# EAGLE schematic Filamint Schematic V3.1 (EAGLE 7.7.0)
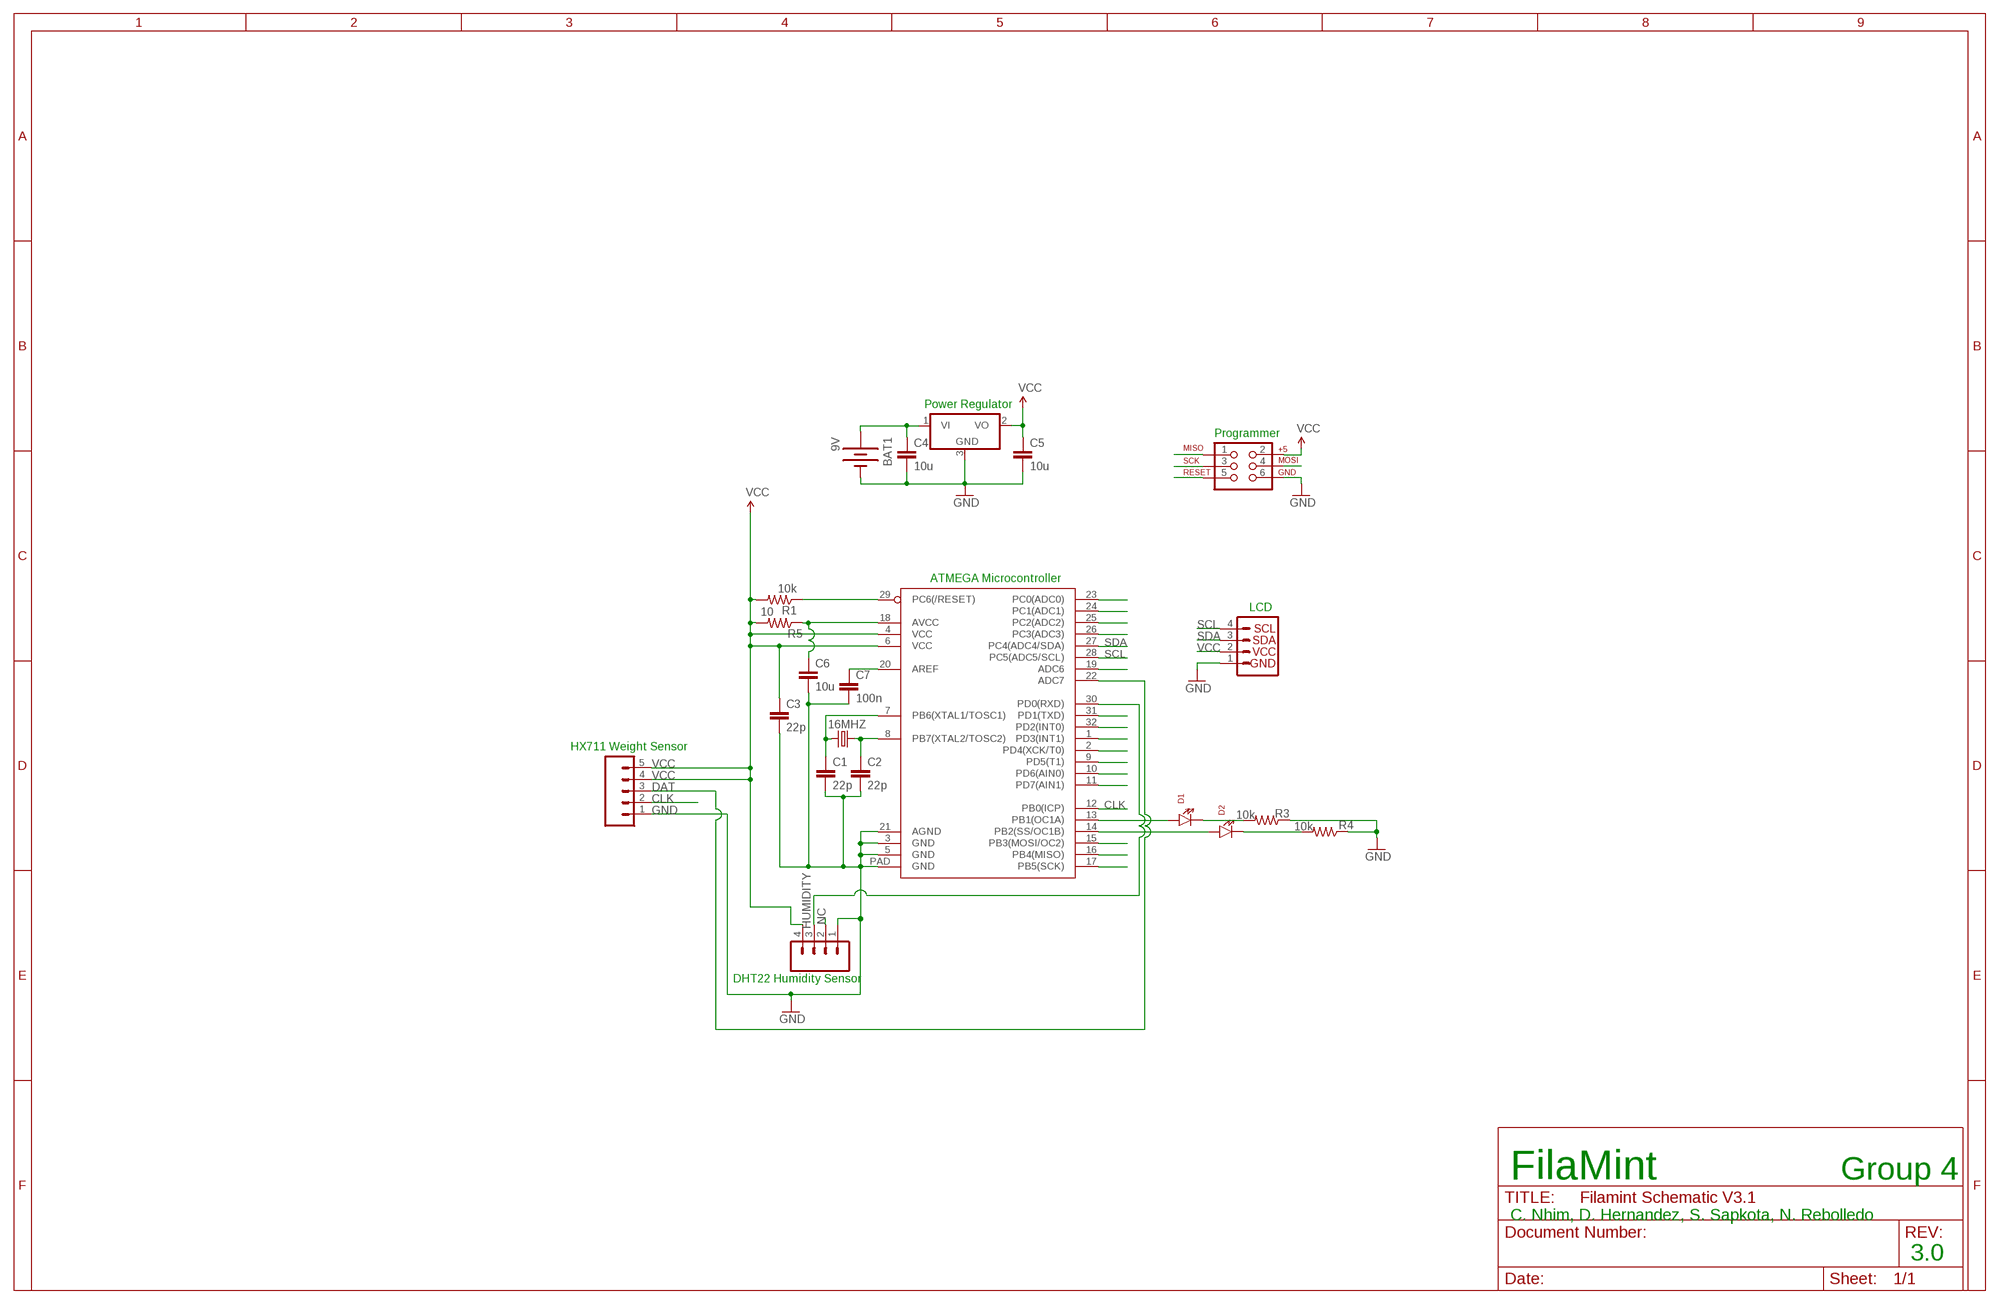
[diagram p0: schematic, sheet 1]

## Parts
16MHZ  CSM-7X-DU  [CSM-7X-DU]
BAT1  9V  BATTERY9V  [BATTCON_9V]
C1  22p  C-EU025-024X044  [C025-024X044]
C2  22p  C-EU025-024X044  [C025-024X044]
C3  22p  C-EU025-024X044  [C025-024X044]
C4  10u  C-EU025-024X044  [C025-024X044]
C5  10u  C-EU025-024X044  [C025-024X044]
C6  10u  C-EU025-024X044  [C025-024X044]
C7  100n  C-EU025-024X044  [C025-024X044]
D1  LTE-302  [LTE-302]
D2  LTE-302  [LTE-302]
DHT22  M04SMD2  [1X04-1MM-RA]
HX711  M05SMD  [1X05-1MM]
IC1  7805DT  [TO252]
LCD  I2C_STANDARD  [1X04]
MICROCONTROLLER  ATMEGA328P_MLFMLF32  [MLF32-PAD]
PROGRAMMER  AVR_SPI_PRG_6PTH  [2X3]
R1  10k  R-US_0204/5  [0204/5]
R3  10k  R-US_0204/5  [0204/5]
R4  10k  R-US_0204/5  [0204/5]
R5  10  R-US_0204/5  [0204/5]

## Nets
AVCC: C6.1 MICROCONTROLLER.18(AVCC) R5.1
CLK: HX711.2 MICROCONTROLLER.12(PB0(ICP))
DAT: HX711.3 MICROCONTROLLER.22(ADC7)
GND: BAT1.- C1.2 C2.2 C3.2 C4.2 C5.2 C6.2 C7.2 DHT22.1 HX711.1 IC1.3(GND) LCD.1 MICROCONTROLLER.3(GND) MICROCONTROLLER.5(GND) MICROCONTROLLER.21(AGND) MICROCONTROLLER.PAD(GND) PROGRAMMER.6 R3.1 R4.1
HUMIDITY: DHT22.3 MICROCONTROLLER.30(PD0(RXD))
MISO: MICROCONTROLLER.16(PB4(MISO)) PROGRAMMER.1
MOSI: MICROCONTROLLER.15(PB3(MOSI/OC2)) PROGRAMMER.4
N$1: 16MHZ.2 C1.1 MICROCONTROLLER.7(PB6(XTAL1/TOSC1))
N$2: 16MHZ.1 C2.1 MICROCONTROLLER.8(PB7(XTAL2/TOSC2))
N$3: BAT1.+ C4.1 IC1.1(VI)
N$4: MICROCONTROLLER.23(PC0(ADC0))
N$5: MICROCONTROLLER.24(PC1(ADC1))
N$6: MICROCONTROLLER.25(PC2(ADC2))
N$7: MICROCONTROLLER.26(PC3(ADC3))
N$8: MICROCONTROLLER.29(PC6(/RESET)) R1.1
N$9: C7.1 MICROCONTROLLER.20(AREF)
N$10: MICROCONTROLLER.19(ADC6)
N$13: MICROCONTROLLER.31(PD1(TXD))
N$14: MICROCONTROLLER.32(PD2(INT0))
N$15: MICROCONTROLLER.1(PD3(INT1))
N$16: MICROCONTROLLER.2(PD4(XCK/T0))
N$17: MICROCONTROLLER.9(PD5(T1))
N$18: MICROCONTROLLER.10(PD6(AIN0))
N$19: MICROCONTROLLER.11(PD7(AIN1))
N$21: D1.A MICROCONTROLLER.13(PB1(OC1A))
N$22: D2.A MICROCONTROLLER.14(PB2(SS/OC1B))
N$24: D1.C R3.2
N$25: D2.C R4.2
NC: DHT22.2
RESET: PROGRAMMER.5
SCK: MICROCONTROLLER.17(PB5(SCK)) PROGRAMMER.3
SCL: LCD.4 MICROCONTROLLER.28(PC5(ADC5/SCL))
SDA: LCD.3 MICROCONTROLLER.27(PC4(ADC4/SDA))
VCC: C3.1 C5.1 DHT22.4 HX711.4 HX711.5 IC1.2(VO) LCD.2 MICROCONTROLLER.4(VCC) MICROCONTROLLER.6(VCC) PROGRAMMER.2 R1.2 R5.2

## Notes on the sheet
- Power Regulator
- Programmer
- ATMEGA Microcontroller
- LCD
- HX711 Weight Sensor
- DHT22 Humidity Sensor
- FilaMint | Group 4
- C. Nhim, D. Hernandez, S. Sapkota, N. Rebolledo
- 3.0

## Library data of the parts
16MHZ = crystal:CSM-7X-DU: SMD CRYSTAL Source: www.ecsxtal.com .. Crystal 3.6864MHz CSM_7X_DU.PDF; OC_FARNELL: unknown; OC_NEWARK: unknown
BAT1 = SparkFun-Electromechanical:BATTERY: Battery Holders Various common sizes : AA, AAA, 18650 (PRT-12895), 20mm coin cell and 12mm coin cell. 20MM_4LEGS, BATT-10373
C1-C7 = rcl:C-EU: CAPACITOR, European symbol
D1 D2 = SparkFun-LED:LTE-302: Through-hole side-firing 940nm IR LED
DHT22 = SparkFun-Connectors:M04: Header 4 Standard 4-pin 0.1" header. Use with straight break away headers (SKU : PRT-00116), right angle break away headers (PRT-00553), swiss pins (PRT-00743), machine pins (PRT-00117), and female headers (PRT-00115). Molex polarized connector foot print use with SKU : PRT-08231 with associated crimp pins and housings. 1MM SMD Version SKU: PRT-10208
HX711 = SparkFun-Connectors:M05: Header 5 Standard 5-pin 0.1" header. Use with straight break away headers (SKU : PRT-00116), right angle break away headers (PRT-00553), swiss pins (PRT-00743), machine pins (PRT-00117), and female headers (PRT-00115). Molex polarized connector foot print use with SKU : PRT-08230 with associated crimp pins and housings.
IC1 = linear:78*: Positive VOLTAGE REGULATOR Source: http://cache.national.com/ds/LM/LM78L05.pdf http://www.fairchildsemi.com/ds/LM/LM7805.pdf
LCD = SparkFun-Connectors:I2C_STANDARD: SparkFun has standardized on a pinout for all I2C based sensor breakouts. This pinout allows I2C boards to be plugged directly into the headers on Arduino Uno compatible boards, and to be daisy chained easily.
MICROCONTROLLER = SparkFun-DigitalIC:ATMEGA328P_MLF: 32-Pin Atmega328 part Commonly used on Arduino compatible boards Available in QFP and QFN packages TQFP is IC-09069 QFN is non-stock
PROGRAMMER = SparkFun-Connectors:AVR_SPI_PRG_6: AVR ISP 6 Pin This is the reduced ISP connector for AVR programming. Common on Arduino. This footprint will take up less PCB space and can be used with a 10-pin to 6-pin adapter such as SKU: BOB-08508 **Special note about "TEST_POINT" package. The stop mask is on the top side, so if you want your programming test points to be on the bottom of your board, make sure to place this package on the bottom side of the board. This also ensure that the orientation to program from the bottom side will be correct.
R1 R3-R5 = rcl:R-US_: RESISTOR, American symbol